# EAGLE design PFD Board (EAGLE 9.6.2)
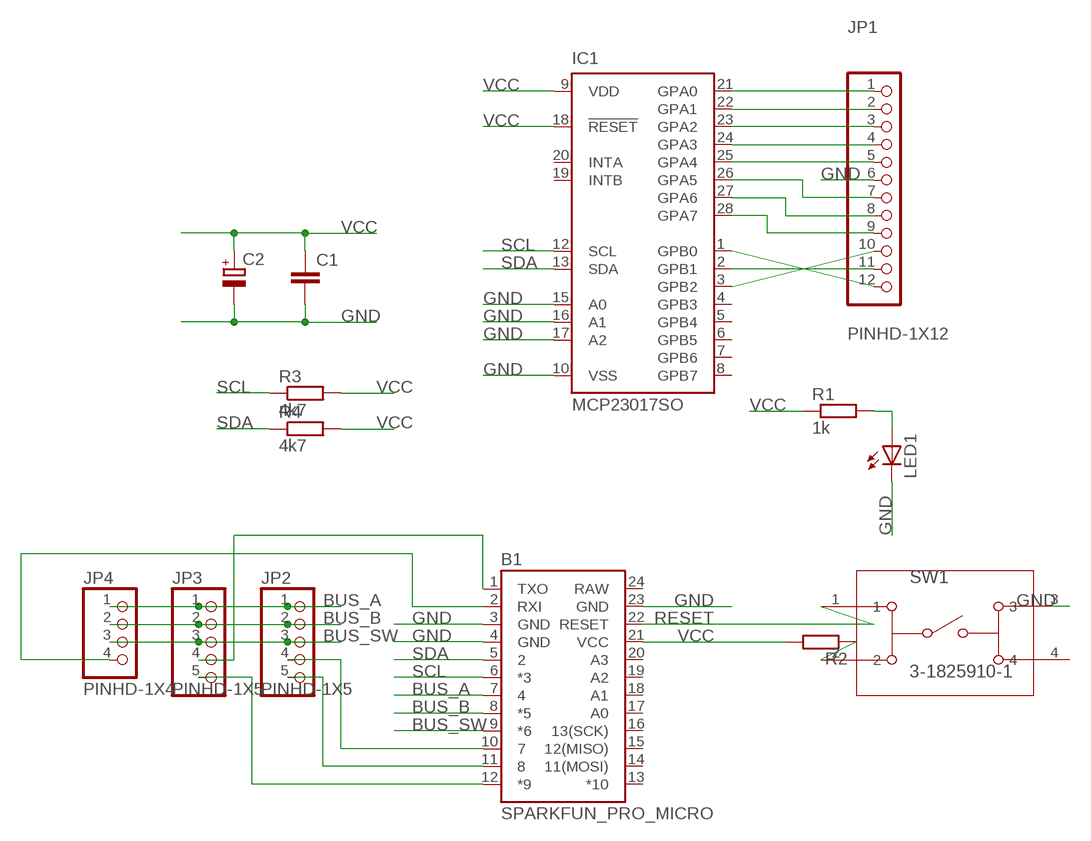
[diagram p0: schematic, sheet 1]

## Parts
B1  SPARKFUN_PRO_MICRO  [SPARKFUN_PRO_MICRO]
C1  C-EU025-025X050  [C025-025X050]
C2  CPOL-EUE2.5-5  [E2,5-5]
IC1  MCP23017SO  [SO28W]
JP1  PINHD-1X12  [1X12]
JP2  PINHD-1X5  [1X05]
JP3  PINHD-1X5  [1X05]
JP4  PINHD-1X4  [1X04]
LED1  LED3MM  [LED3MM]
R1  1k  R-EU_0207/10  [0207/10]
R2  R-EU_0207/10  [0207/10]
R3  4k7  R-EU_0207/10  [0207/10]
R4  4k7  R-EU_0207/10  [0207/10]
SW1  3-1825910-1  [SW4_1825910-H]

## Nets
BUS_A: B1.7 JP2.1 JP3.1 JP4.1
BUS_B: B1.8(*5) JP2.2 JP3.2 JP4.2
BUS_SW: B1.9(*6) JP2.3 JP3.3 JP4.3
GND: B1.3(GND) B1.4(GND) B1.23(GND) C1.2 C2.- IC1.10(VSS) IC1.15(A0) IC1.16(A1) IC1.17(A2) JP1.6 LED1.K(C) SW1.3
N$1: B1.10 JP2.4
N$2: B1.11 JP2.5
N$3: B1.12(*9) JP3.5
N$4: B1.2(RXI) JP4.4
N$5: B1.1(TXO) JP3.4
N$6: IC1.21(GPA0) JP1.1
N$7: IC1.22(GPA1) JP1.2
N$8: IC1.23(GPA2) JP1.3
N$9: IC1.24(GPA3) JP1.4
N$10: IC1.25(GPA4) JP1.5
N$11: IC1.1(GPB0) JP1.12
N$12: IC1.26(GPA5) JP1.7
N$13: IC1.27(GPA6) JP1.8
N$14: IC1.28(GPA7) JP1.9
N$15: IC1.3(GPB2) JP1.10
N$16: IC1.2(GPB1) JP1.11
N$18: LED1.A R1.2
N$21: R2.1 SW1.2
RESET: B1.22(RESET) SW1.1
SCL: B1.6(*3) IC1.12(SCL) R3.1
SDA: B1.5 IC1.13(SDA) R4.1
VCC: B1.21(VCC) C1.1 C2.+ IC1.9(VDD) IC1.18(!RESET) R1.1 R2.2 R3.2 R4.2
Unconnected: B1.13(*10) B1.14(11(MOSI)) B1.15(12(MISO)) B1.16(13(SCK)) B1.17(A0) B1.18(A1) B1.19(A2) B1.20(A3) IC1.4(GPB3) IC1.5(GPB4) IC1.6(GPB5) IC1.7(GPB6) IC1.8(GPB7) IC1.19(INTB) IC1.20(INTA) SW1.4

## Power pins joined to a net without a drawn wire
RAW: B1.24(RAW)

## Library data of the parts
B1 = SparkFun-Boards:SPARKFUN_PRO_MICRO: SparkFun Pro Micro Atmega32U4 compatible footprint. SparkFun Products: 3.3V/8MHz <https://www.sparkfun.com/products/12587> 5V/16MHz <https://www.sparkfun.com/products/12640>
C1 = rcl:C-EU: CAPACITOR, European symbol; SPICEPREFIX: C
C2 = rcl:CPOL-EU: POLARIZED CAPACITOR, European symbol; SPICEPREFIX: C
IC1 = adafruit:MCP23017: http://ww1.microchip.com/downloads/en/DeviceDoc/21952a.pdf Source: http://ww1.microchip.com/downloads/en/DeviceDoc/21952a.pdf
JP1 = Connector:PINHD-1X12: PIN HEADER; CATEGORY: CONNECTOR; SUB-CATEGORY: PIN-HEADER
JP2 JP3 = Connector:PINHD-1X5: PIN HEADER; CATEGORY: CONNECTOR; SUB-CATEGORY: PIN-HEADER
JP4 = Connector:PINHD-1X4: PIN HEADER; CATEGORY: CONNECTOR; SUB-CATEGORY: PIN-HEADER
LED1 = adafruit:LED: LED OSRAM: - CHIPLED LG R971, LG N971, LY N971, LG Q971, LY Q971, LO R971, LY R971 LH N974, LH R974 LS Q976, LO Q976, LY Q976 LO Q996 - Hyper CHIPLED LW Q18S LB Q993, LB Q99A, LB R99A - SideLED LS A670, LO A670, LY A670, LG A670, LP A670 LB A673, LV A673, LT A673, LW A673 LH A674 LY A675 LS A676, LA A676, LO A676, LY A676, LW A676 LS A679, LY A679, LG A679 - Hyper Micro SIDELED® LS Y876, LA Y876, LO Y876, LY Y876 LT Y87S - SmartLED LW L88C, LW L88S LB L89C, LB L89S, LG L890 LS L89K, LO L89K, LY L89K LS L896, LA L896, LO L896, LY L896 - TOPLED LS T670, LO T670, LY T670, LG T670, LP T670 LSG T670, LSP T670, LSY T670, LOP T670, LYG T670 LG T671, LOG T671, LSG T671 LB T673, LV T673, LT T673, LW T673 LH T674 LS T676, LA T676, LO T676, LY T676, LB T676, LH T676, LSB T676, LW T676 LB T67C, LV T67C, LT T67C, LS T67K, LO T67K, LY T67K, LW E67C LS E67B, LA E67B, LO E67B, LY E67B, LB E67C, LV E67C, LT E67C LW T67C LS T679, LY T679, LG T679 LS T770, LO T770, LY T770, LG T770, LP T770 LB T773, LV T773, LT T773, LW T773 LH T774 LS E675, LA E675, LY E675, LS T675 LS T776, LA T776, LO T776, LY T776, LB T776 LHGB T686 LT T68C, LB T68C - Hyper Mini TOPLED® LB M676 - Mini TOPLED Santana® LG M470 LS M47K, LO M47K, LY M47K Source: http://www.osram.convergy.de/
R1-R4 = rcl:R-EU_: RESISTOR, European symbol; SPICEPREFIX: R
SW1 = Switches:3-1825910-1; BUILT_BY: EMA_UL_Team; CATEGORY: Tactile Switches; CONFIGURATION__POLE-THROW_: Single Pole - Single Throw; COPYRIGHT: Copyright (C) 2016 Accelerated Designs. All rights reserved; DESCRIPTION: FSM16JH=6MM TACT SWITCH, HIGH TEMP; MANUFACTURER_PART_NUMBER: 3-1825910-1; MAX_SWITCHING_CURRENT: -; MAX_SWITCHING_VOLTAGE_AC_: -; PART_STATUS: active; PRODUCT_TYPE: Switch; SERIES: Unknown; SWITCH_TYPE: Tactile Switches; TE_PART_NUMBER: 3-1825910-1; VENDOR: TE Connectivity

## Board
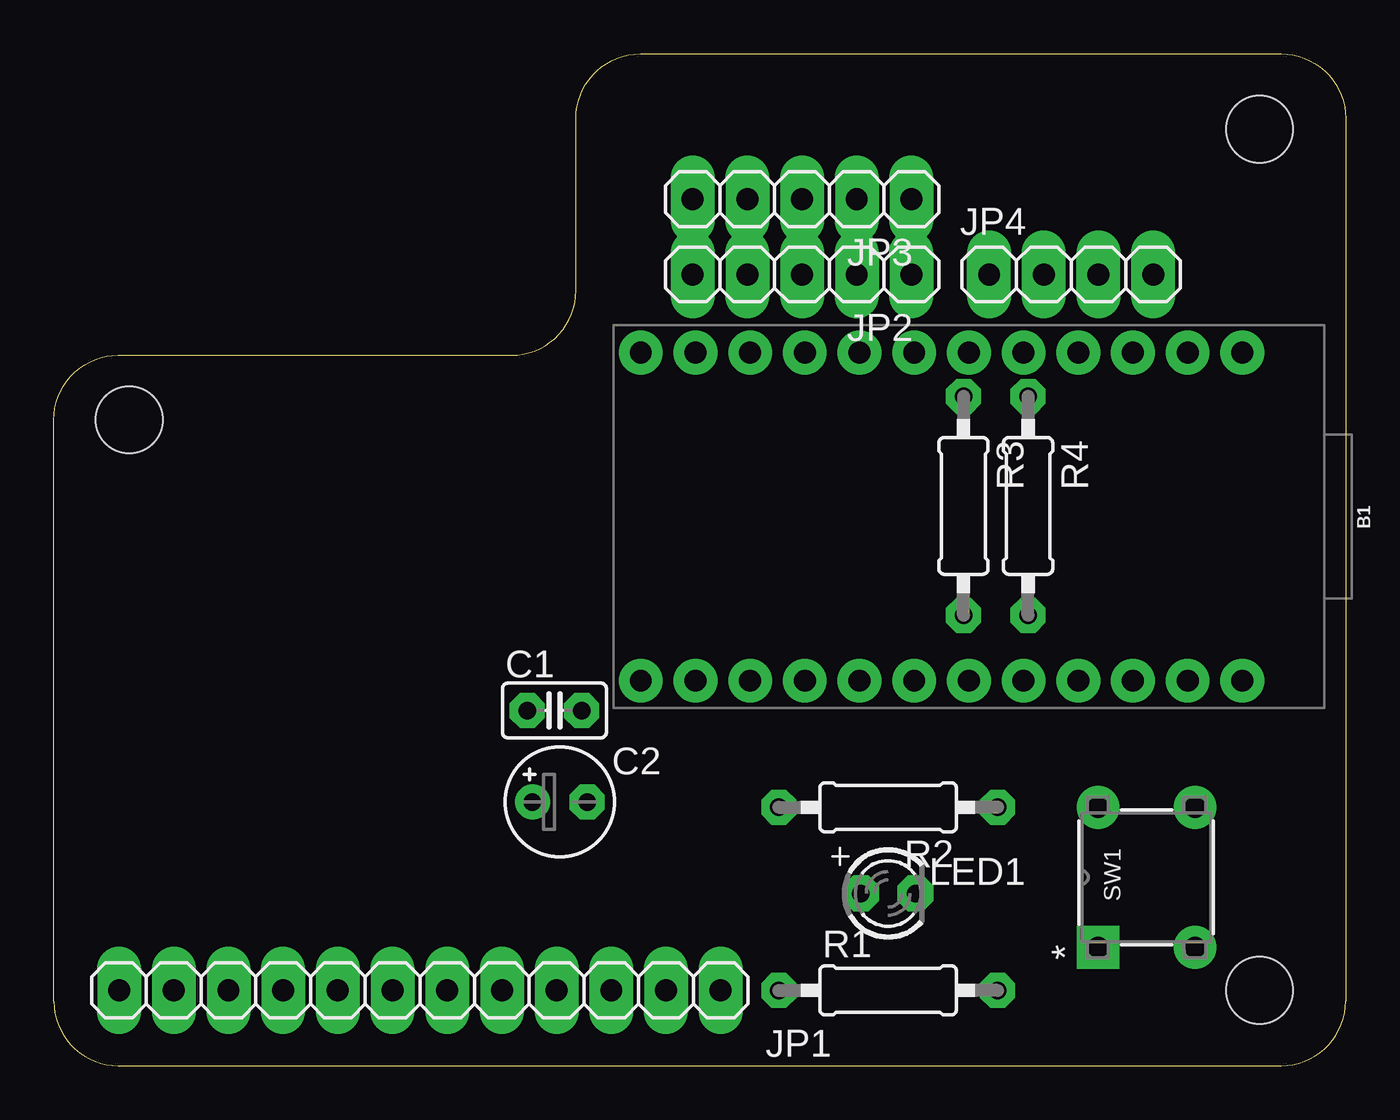
[diagram p1: board, top side]
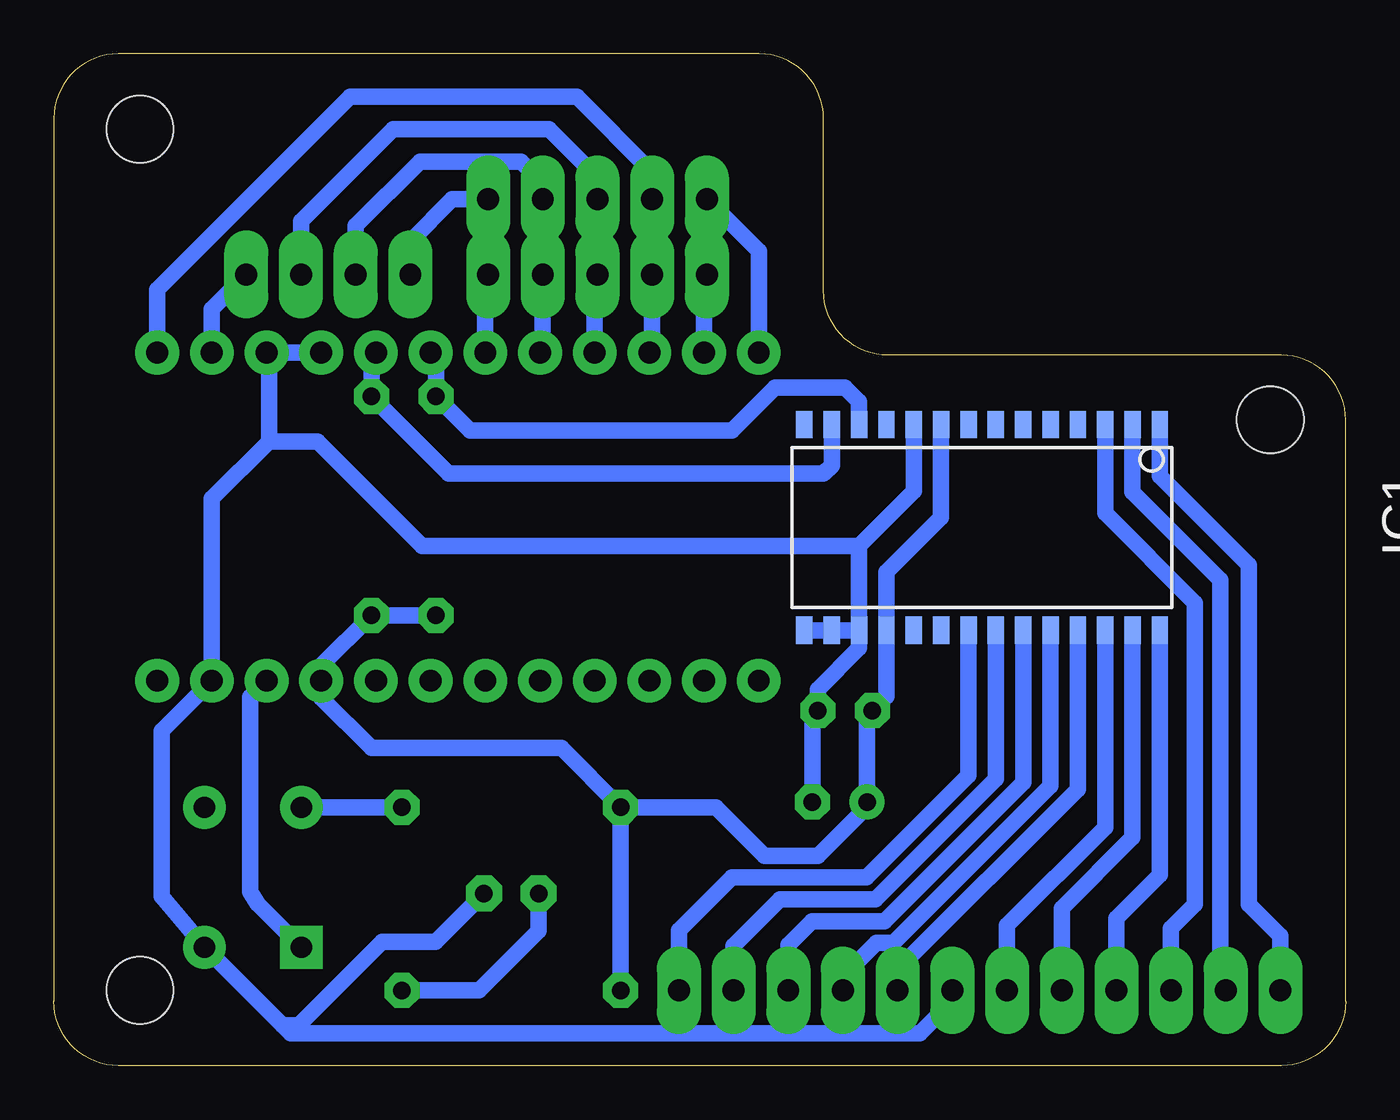
[diagram p2: board, bottom side, seen from below]

Size 60 x 47 mm. Coordinates in mm from the lower left corner, seen from the top.
Outline: 3,0 57,0 arc90 60,3 60,44 arc90 57,47 27.25,47 arc90 24.25,44 24.25,36 arc-90 21.25,33 3,33 arc90 0,30 0,3 arc90 3,0
Copper layers (1*16): Top 0.035mm / dielectric 1.5mm / Bottom 0.035mm
Design rules "swidzi_milling_3018_smd_test *": minimum track width 20mil, minimum drill 0.8mm, track to track 0.25mm, track to pad 0.25mm, pad to pad 0.25mm, via to via 6mil, smd to smd 6mil, copper to edge 15mil, drill to drill 6mil, minimum pad ring 10mil, minimum via ring 8mil, stop-mask expansion 4mil, vias tented up to drill 0mil, thermal gap 10mil
Holes 3.1 mm at 3.5,30 56,3.5 56,43.5

### Footprints (pad centres in the part's own frame; a part is rotated, then mirrored left to right if it is on the bottom)
SPARKFUN_PRO_MICRO = drill 1.016 pad 1.88: 1 -7.62,12.7; 2 -7.62,10.16; 3 -7.62,7.62; 4 -7.62,5.08; 5 -7.62,2.54; 6 -7.62,0; 7 -7.62,-2.54; 8 -7.62,-5.08; 9 -7.62,-7.62; 10 -7.62,-10.16; 11 -7.62,-12.7; 12 -7.62,-15.24; 13 7.62,-15.24; 14 7.62,-12.7; 15 7.62,-10.16; 16 7.62,-7.62; 17 7.62,-5.08; 18 7.62,-2.54; 19 7.62,0; 20 7.62,2.54; 21 7.62,5.08; 22 7.62,7.62; 23 7.62,10.16; 24 7.62,12.7
C025-025X050 = drill 0.813 octagon: 1 -1.27,0; 2 1.27,0
E2,5-5 = drill 0.813 pad 1.6: + -1.27,0 | drill 0.813 pad 1.6 octagon: - 1.27,0
SO28W = smd 0.762 x 1.27: 1 -7.62,-4.78; 2 -6.35,-4.78; 3 -5.08,-4.78; 4 -3.81,-4.78; 5 -2.54,-4.78; 6 -1.27,-4.78; 7 0,-4.78; 8 1.27,-4.78; 9 2.54,-4.78; 10 3.81,-4.78; 11 5.08,-4.78; 12 6.35,-4.78; 13 7.62,-4.78; 14 8.89,-4.78; 15 8.89,4.78; 16 7.62,4.78; 17 6.35,4.78; 18 5.08,4.78; 19 3.81,4.78; 20 2.54,4.78; 21 1.27,4.78; 22 0,4.78; 23 -1.27,4.78; 24 -2.54,4.78; 25 -3.81,4.78; 26 -5.08,4.78; 27 -6.35,4.78; 28 -7.62,4.78
1X12 = drill 1.016 long: 1 -13.97,0; 2 -11.43,0; 3 -8.89,0; 4 -6.35,0; 5 -3.81,0; 6 -1.27,0; 7 1.27,0; 8 3.81,0; 9 6.35,0; 10 8.89,0; 11 11.43,0; 12 13.97,0
1X05 = drill 1.016 long: 1 -5.08,0; 2 -2.54,0; 3 0,0; 4 2.54,0; 5 5.08,0
1X04 = drill 1.016 long: 1 -3.81,0; 2 -1.27,0; 3 1.27,0; 4 3.81,0
LED3MM = drill 0.813 pad 1.676 octagon: A -1.27,0; K 1.27,0
0207/10 = drill 0.813 octagon: 1 -5.08,0; 2 5.08,0
SW4_1825910-H = drill 0.991 pad 1.499 square: 1 -6.502,4.496 | drill 0.991 pad 1.499: 2 0,4.496; 3 -6.502,0; 4 0,0

### Placement (x,y rotation side)
B1  42.5,25.5 270 top
C1  23.25,16.5 0 top
C2  23.5,12.25 0 top
IC1  16.25,25 180 bottom
JP1  17,3.5 180 top
JP2  34.75,36.75 180 top
JP3  34.75,40.25 180 top
JP4  47.25,36.75 0 top
LED1  38.75,8 0 top
R1  38.75,3.5 0 top
R2  38.75,12 180 top
R3  42.25,26 270 top
R4  45.25,26 270 top
SW1  53,12 90 top

### Tracks (layer width: path | path; a pad name or v marks a point on that pad's centre or on a via)
BUS_A
  Bottom 0.762: B1.7 39.96,36.62 JP2.1 JP3.1 41.5,40.25 43.44,38.31 JP4.1
BUS_B
  Bottom 0.762: B1.8 37.29,33.25 JP2.2 JP3.2 37.29,41 38.29,42 43,42 45.98,39.02 JP4.2
BUS_SW
  Bottom 0.762: B1.9 34.88,36.62 JP2.3 JP3.3 34.75,41.25 37,43.5 44.25,43.5 48.52,39.23 JP4.3
GND
  Bottom 0.762: IC1.17 22.6,19.4 24.52,17.48 C1.2 24.77,16.25 C2.- | IC1.17 IC1.16 IC1.15 | IC1.17 22.6,24.15 | IC1.10 20.06,26.69 22.6,24.15 | SW1.3 55,7.86 55,15.54 B1.23 52.66,26.34 50,29 | 50,29 50,33 B1.3 B1.4 | 50,29 47.75,29 42.9,24.15 22.6,24.15 | LED1.K 42.27,5.75 44.75,5.75 48.63,1.87 49.38,1.87 | SW1.3 53.15,5.75 53.25,5.75 | JP1.6 18.27,3 19.77,1.5 49,1.5 49.38,1.87 | 49.38,1.87 SW1.3
N$1
  Bottom 0.762: B1.10 32.21,33.25 JP2.4
N$2
  Bottom 0.762: B1.11 29.8,36.62 JP2.5
N$3
  Bottom 0.762: JP3.5 27.26,37.84 B1.12
N$4
  Bottom 0.762: JP4.4 52.66,35.15 B1.2
N$5
  Bottom 0.762: JP3.4 32.21,41.5 35.71,45 46.25,45 55.2,36.05 B1.1
N$6
  Bottom 0.762: JP1.1 30.97,6.28 28.51,8.74 24.08,8.74 24.07,8.75 22.25,8.75 17.52,13.48 IC1.21
N$7
  Bottom 0.762: JP1.2 28.43,5.57 26.27,7.73 21.84,7.73 16.25,13.32 IC1.22
N$8
  Bottom 0.762: JP1.3 25.89,5.61 24.79,6.71 21.42,6.71 14.98,13.16 IC1.23
N$9
  Bottom 0.762: JP1.4 23.35,4.15 21.8,5.7 21,5.7 13.71,13 IC1.24
N$10
  Bottom 0.762: JP1.5 20.81,4.46 12.44,12.84 IC1.25
N$11
  Bottom 0.762: JP1.12 3.03,6.03 4.5,7.5 4.5,23.25 8.63,27.38 IC1.1
N$12
  Bottom 0.762: JP1.7 15.73,6.52 11.17,11.08 IC1.26
N$13
  Bottom 0.762: IC1.27 9.9,10.6 13.19,7.31 JP1.8
N$14
  Bottom 0.762: JP1.9 10.65,6.85 8.63,8.87 IC1.28
N$15
  Bottom 0.762: JP1.10 8.11,6.39 7,7.5 7,21.5 11.17,25.67 IC1.3
N$16
  Bottom 0.762: JP1.11 5.82,3.75 5.82,22.57 9.9,26.65 IC1.2
N$18
  Bottom 0.762: R1.2 40.25,3.5 37.48,6.27 LED1.A
N$21
  Bottom 0.762: R2.1 SW1.2
RESET
  Bottom 0.762: SW1.1 50.53,7.52 50.87,8.06 50.87,17.13 B1.22
SCL
  Bottom 0.762: IC1.12 22.6,30.85 23.25,31.5 26.5,31.5 28.5,29.5 40.67,29.5 R3.1 42.25,32.87 B1.6
SDA
  Bottom 0.762: IC1.13 23.87,27.88 24.25,27.5 41.67,27.5 R4.1 45.25,32.91 B1.5
VCC
  Bottom 0.762: IC1.9 18.79,25.46 21.33,22.92 IC1.18 21.33,17.15 C1.1 22.23,16.25 C2.+ 22.23,12.02 24.5,9.75 27,9.75 29.25,12 R2.2 | R3.2 R4.2 47.58,18.59 B1.21 47.58,17.08 45.25,14.75 36.42,14.75 R2.2 | R1.1 R2.2